# EAGLE design CME_BLE_Light (EAGLE 8.6.3)

## Sheet 1 of 3
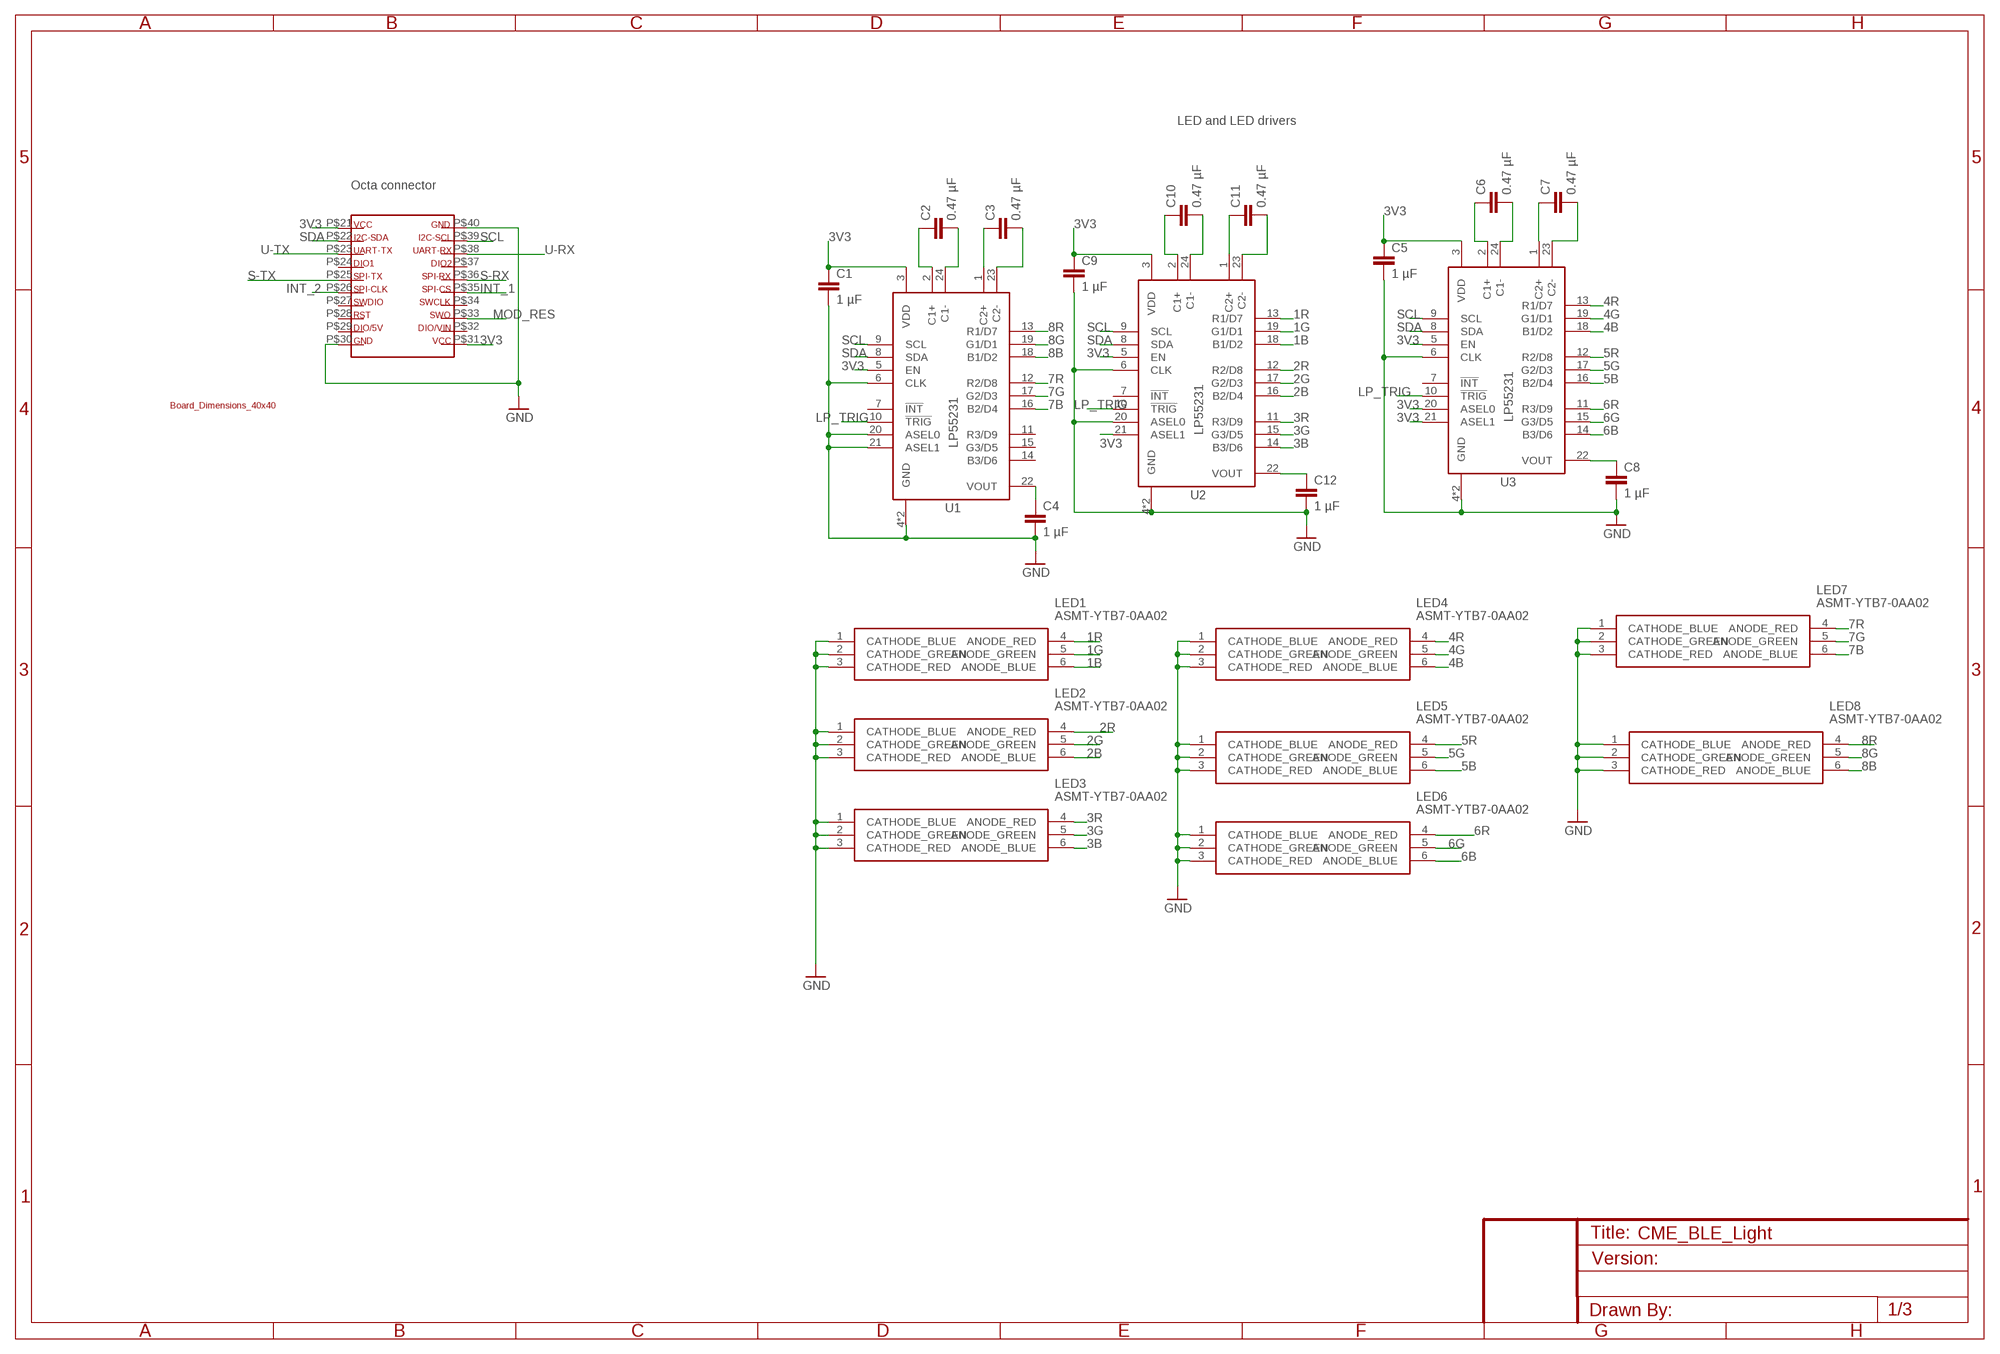
[diagram p0: schematic, sheet 1]

### Parts
C1  1 µF  SPARKFUN_CAP0402-CAP  [SPARKFUN_0402-CAP]
C2  0.47 µF  SPARKFUN_CAP0402-CAP  [SPARKFUN_0402-CAP]
C3  0.47 µF  SPARKFUN_CAP0402-CAP  [SPARKFUN_0402-CAP]
C4  1 µF  SPARKFUN_CAP0402-CAP  [SPARKFUN_0402-CAP]
C5  1 µF  SPARKFUN_CAP0402-CAP  [SPARKFUN_0402-CAP]
C6  0.47 µF  SPARKFUN_CAP0402-CAP  [SPARKFUN_0402-CAP]
C7  0.47 µF  SPARKFUN_CAP0402-CAP  [SPARKFUN_0402-CAP]
C8  1 µF  SPARKFUN_CAP0402-CAP  [SPARKFUN_0402-CAP]
C9  1 µF  SPARKFUN_CAP0402-CAP  [SPARKFUN_0402-CAP]
C10  0.47 µF  SPARKFUN_CAP0402-CAP  [SPARKFUN_0402-CAP]
C11  0.47 µF  SPARKFUN_CAP0402-CAP  [SPARKFUN_0402-CAP]
C12  1 µF  SPARKFUN_CAP0402-CAP  [SPARKFUN_0402-CAP]
LED1  ASMT-YTB7-0AA02  [ASMT-YTC7-0AA02]
LED2  ASMT-YTB7-0AA02  [ASMT-YTC7-0AA02]
LED3  ASMT-YTB7-0AA02  [ASMT-YTC7-0AA02]
LED4  ASMT-YTB7-0AA02  [ASMT-YTC7-0AA02]
LED5  ASMT-YTB7-0AA02  [ASMT-YTC7-0AA02]
LED6  ASMT-YTB7-0AA02  [ASMT-YTC7-0AA02]
LED7  ASMT-YTB7-0AA02  [ASMT-YTC7-0AA02]
LED8  ASMT-YTB7-0AA02  [ASMT-YTC7-0AA02]
U1  LP55231  LP55231WQFN  [WQFN-24]
U2  LP55231  LP55231WQFN  [WQFN-24]
U3  LP55231  LP55231WQFN  [WQFN-24]
U$2  OCTA-CORE_BOARD-DIMENSIONS-40X40  [OCTA-CORE_BOARD-DIMENSIONS-40X40]

### Nets
1B [GPIO]: LED1.6(ANODE_BLUE) U2.18(B1/D2)
1G [GPIO]: LED1.5(ANODE_GREEN) U2.19(G1/D1)
1R [GPIO]: LED1.4(ANODE_RED) U2.13(R1/D7)
2B [GPIO]: LED2.6(ANODE_BLUE) U2.16(B2/D4)
2G [GPIO]: LED2.5(ANODE_GREEN) U2.17(G2/D3)
2R [GPIO]: LED2.4(ANODE_RED) U2.12(R2/D8)
3B [GPIO]: LED3.6(ANODE_BLUE) U2.14(B3/D6)
3G [GPIO]: LED3.5(ANODE_GREEN) U2.15(G3/D5)
3R [GPIO]: LED3.4(ANODE_RED) U2.11(R3/D9)
3V3: C1.1 C5.1 C9.1 U1.3(VDD) U1.5(EN) U2.3(VDD) U2.5(EN) U2.21(ASEL1) U3.3(VDD) U3.5(EN) U3.20(ASEL0) U3.21(ASEL1) U$2.P$21 U$2.P$31 ; also sheet 2,3
4B [GPIO]: LED4.6(ANODE_BLUE) U3.18(B1/D2)
4G [GPIO]: LED4.5(ANODE_GREEN) U3.19(G1/D1)
4R [GPIO]: LED4.4(ANODE_RED) U3.13(R1/D7)
5B [GPIO]: LED5.6(ANODE_BLUE) U3.16(B2/D4)
5G [GPIO]: LED5.5(ANODE_GREEN) U3.17(G2/D3)
5R [GPIO]: LED5.4(ANODE_RED) U3.12(R2/D8)
6B [GPIO]: LED6.6(ANODE_BLUE) U3.14(B3/D6)
6G [GPIO]: LED6.5(ANODE_GREEN) U3.15(G3/D5)
6R [GPIO]: LED6.4(ANODE_RED) U3.11(R3/D9)
7B [GPIO]: LED7.6(ANODE_BLUE) U1.16(B2/D4)
7G [GPIO]: LED7.5(ANODE_GREEN) U1.17(G2/D3)
7R [GPIO]: LED7.4(ANODE_RED) U1.12(R2/D8)
8B [GPIO]: LED8.6(ANODE_BLUE) U1.18(B1/D2)
8G [GPIO]: LED8.5(ANODE_GREEN) U1.19(G1/D1)
8R [GPIO]: LED8.4(ANODE_RED) U1.13(R1/D7)
GND [GPIO]: C1.2 C4.2 C5.2 C8.2 C9.2 C12.2 LED1.1(CATHODE_BLUE) LED1.2(CATHODE_GREEN) LED1.3(CATHODE_RED) LED2.1(CATHODE_BLUE) LED2.2(CATHODE_GREEN) LED2.3(CATHODE_RED) LED3.1(CATHODE_BLUE) LED3.2(CATHODE_GREEN) LED3.3(CATHODE_RED) LED4.1(CATHODE_BLUE) LED4.2(CATHODE_GREEN) LED4.3(CATHODE_RED) LED5.1(CATHODE_BLUE) LED5.2(CATHODE_GREEN) LED5.3(CATHODE_RED) LED6.1(CATHODE_BLUE) LED6.2(CATHODE_GREEN) LED6.3(CATHODE_RED) LED7.1(CATHODE_BLUE) LED7.2(CATHODE_GREEN) LED7.3(CATHODE_RED) LED8.1(CATHODE_BLUE) LED8.2(CATHODE_GREEN) LED8.3(CATHODE_RED) U1.4(GND) U1.6(CLK) U1.20(ASEL0) U1.21(ASEL1) U1.EP(GND) U2.4(GND) U2.6(CLK) U2.20(ASEL0) U2.EP(GND) U3.4(GND) U3.6(CLK) U3.EP(GND) U$2.P$30 U$2.P$40 ; also sheet 2,3
INT_1 [GPIO]: U$2.P$35 ; also sheet 2
INT_2 [GPIO]: U$2.P$26 ; also sheet 2
LP_TRIG [GPIO]: U1.10(!TRIG) U2.10(!TRIG) U3.10(!TRIG) ; also sheet 2
MOD_RES [GPIO]: U$2.P$33 ; also sheet 2
N$1 [GPIO]: C2.2 U1.24(C1-)
N$2 [GPIO]: C2.1 U1.2(C1+)
N$4 [GPIO]: C3.1 U1.1(C2+)
N$5 [GPIO]: C3.2 U1.23(C2-)
N$7 [GPIO]: C10.1 U2.2(C1+)
N$8 [GPIO]: C10.2 U2.24(C1-)
N$9 [GPIO]: C11.1 U2.1(C2+)
N$10 [GPIO]: C11.2 U2.23(C2-)
N$11 [GPIO]: C6.1 U3.2(C1+)
N$13 [GPIO]: C6.2 U3.24(C1-)
N$14 [GPIO]: C7.1 U3.1(C2+)
N$15 [GPIO]: C7.2 U3.23(C2-)
N$16: C4.1 U1.22(VOUT)
N$17: C12.1 U2.22(VOUT)
N$18: C8.1 U3.22(VOUT)
S-RX [GPIO]: U$2.P$36 ; also sheet 2
S-TX [GPIO]: U$2.P$25 ; also sheet 2
SCL [GPIO]: U1.9(SCL) U2.9(SCL) U3.9(SCL) U$2.P$39 ; also sheet 2
SDA [GPIO]: U1.8(SDA) U2.8(SDA) U3.8(SDA) U$2.P$22 ; also sheet 2
U-RX [GPIO]: U$2.P$38 ; also sheet 2
U-TX [GPIO]: U$2.P$23 ; also sheet 2
Unconnected: U1.7(!INT) U1.11(R3/D9) U1.14(B3/D6) U1.15(G3/D5) U2.7(!INT) U3.7(!INT) U$2.P$24 U$2.P$27 U$2.P$28 U$2.P$29 U$2.P$32 U$2.P$34 U$2.P$37

### Notes on the sheet
- LED and LED drivers
- Octa connector

## Sheet 2 of 3
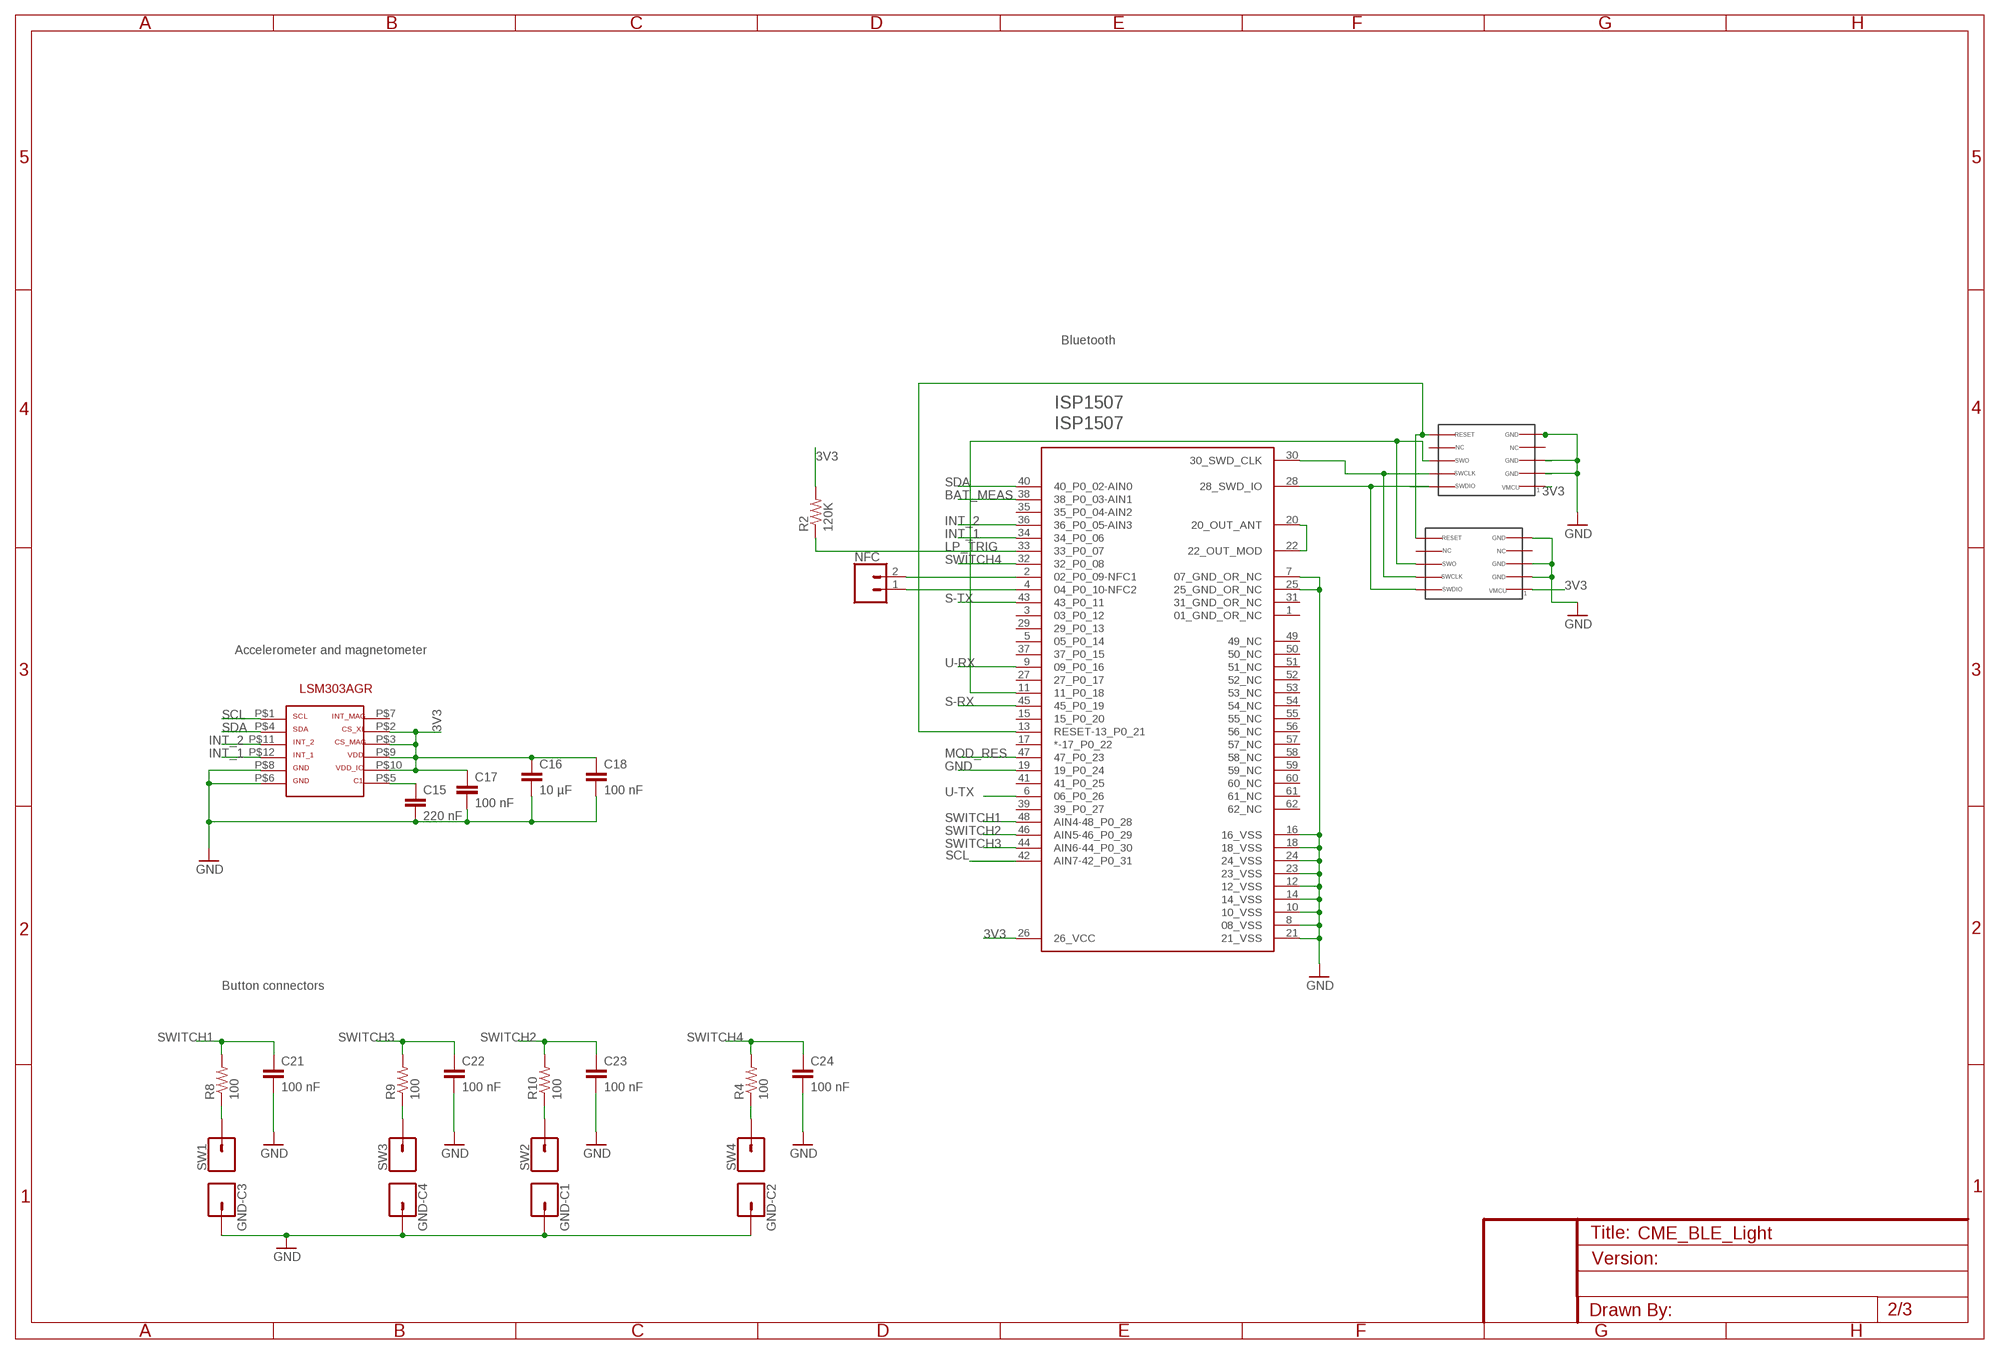
[diagram p1: schematic, sheet 2]

### Parts
C15  220 nF  SPARKFUN_CAP0402-CAP  [SPARKFUN_0402-CAP]
C16  10 µF  SPARKFUN_CAP0402-CAP  [SPARKFUN_0402-CAP]
C17  100 nF  SPARKFUN_CAP0402-CAP  [SPARKFUN_0402-CAP]
C18  100 nF  SPARKFUN_CAP0402-CAP  [SPARKFUN_0402-CAP]
C21  100 nF  SPARKFUN_CAP0402-CAP  [SPARKFUN_0402-CAP]
C22  100 nF  SPARKFUN_CAP0402-CAP  [SPARKFUN_0402-CAP]
C23  100 nF  SPARKFUN_CAP0402-CAP  [SPARKFUN_0402-CAP]
C24  100 nF  SPARKFUN_CAP0402-CAP  [SPARKFUN_0402-CAP]
GND-C1  CONN_01  [1X01]
GND-C2  CONN_01  [1X01]
GND-C3  CONN_01  [1X01]
GND-C4  CONN_01  [1X01]
ISP1507  ISP1507  [ISP1507]
LSM303AGR  LSM303AGRTR  [LSM303AGRTR]
NFC  CONN_02  [1X02]
R2  120K  SPARKFUN_RESISTOR0402-RES  [SPARKFUN_0402-RES]
R4  100  SPARKFUN_RESISTOR0402-RES  [SPARKFUN_0402-RES]
R8  100  SPARKFUN_RESISTOR0402-RES  [SPARKFUN_0402-RES]
R9  100  SPARKFUN_RESISTOR0402-RES  [SPARKFUN_0402-RES]
R10  100  SPARKFUN_RESISTOR0402-RES  [SPARKFUN_0402-RES]
SW1  CONN_01  [1X01]
SW2  CONN_01  [1X01]
SW3  CONN_01  [1X01]
SW4  CONN_01  [1X01]
U$1  DRAGAN-PERSONAL_SEGGER-CONN  [DRAGAN-PERSONAL_SEGGER-CONN]
U$3  DRAGAN-PERSONAL_SEGGER-CONN  [DRAGAN-PERSONAL_SEGGER-CONN]

### Nets
3V3: C16.1 C17.1 C18.1 ISP1507.26(26_VCC) LSM303AGR.P$2 LSM303AGR.P$3 LSM303AGR.P$9 LSM303AGR.P$10 R2.2 U$1.P$5 U$3.P$5 ; also sheet 1,3
BAT_MEAS [GPIO]: ISP1507.38(38_P0_03-AIN1) ; also sheet 3
GND [GPIO]: C15.2 C16.2 C17.2 C18.2 C21.2 C22.2 C23.2 C24.2 GND-C1.1 GND-C2.1 GND-C3.1 GND-C4.1 ISP1507.7(07_GND_OR_NC) ISP1507.8(08_VSS) ISP1507.10(10_VSS) ISP1507.12(12_VSS) ISP1507.14(14_VSS) ISP1507.16(16_VSS) ISP1507.18(18_VSS) ISP1507.19(19_P0_24) ISP1507.21(21_VSS) ISP1507.23(23_VSS) ISP1507.24(24_VSS) ISP1507.25(25_GND_OR_NC) LSM303AGR.P$6 LSM303AGR.P$8 U$1.P$1 U$1.P$3 U$1.P$4 U$3.P$1 U$3.P$3 U$3.P$4 ; also sheet 1,3
INT_1 [GPIO]: ISP1507.34(34_P0_06) LSM303AGR.P$12 ; also sheet 1
INT_2 [GPIO]: ISP1507.36(36_P0_05-AIN3) LSM303AGR.P$11 ; also sheet 1
LP_TRIG [GPIO]: ISP1507.33(33_P0_07) R2.1 ; also sheet 1
MOD_RES [GPIO]: ISP1507.47(47_P0_23) ; also sheet 1
N$22 [GPIO]: C15.1 LSM303AGR.P$5
N$24 [GPIO]: ISP1507.20(20_OUT_ANT) ISP1507.22(22_OUT_MOD)
N$25 [GPIO]: ISP1507.2(02_P0_09-NFC1) NFC.2
N$26 [GPIO]: ISP1507.4(04_P0_10-NFC2) NFC.1
N$27: R8.1 SW1.1
N$28: R10.1 SW2.1
N$31: R9.1 SW3.1
N$32: R4.1 SW4.1
RST [GPIO]: ISP1507.13(RESET-13_P0_21) U$1.P$10 U$3.P$10
S-RX [GPIO]: ISP1507.45(45_P0_19) ; also sheet 1
S-TX [GPIO]: ISP1507.43(43_P0_11) ; also sheet 1
SCL [GPIO]: ISP1507.42(AIN7-42_P0_31) LSM303AGR.P$1 ; also sheet 1
SDA [GPIO]: ISP1507.40(40_P0_02-AIN0) LSM303AGR.P$4 ; also sheet 1
SWCLK [GPIO]: ISP1507.30(30_SWD_CLK) U$1.P$7 U$3.P$7
SWDIO [GPIO]: ISP1507.28(28_SWD_IO) U$1.P$6 U$3.P$6
SWITCH1 [GPIO]: C21.1 ISP1507.48(AIN4-48_P0_28) R8.2
SWITCH2 [GPIO]: C23.1 ISP1507.46(AIN5-46_P0_29) R10.2
SWITCH3 [GPIO]: C22.1 ISP1507.44(AIN6-44_P0_30) R9.2
SWITCH4 [GPIO]: C24.1 ISP1507.32(32_P0_08) R4.2
SWO [GPIO]: ISP1507.11(11_P0_18) U$1.P$8 U$3.P$8
U-RX [GPIO]: ISP1507.9(09_P0_16) ; also sheet 1
U-TX [GPIO]: ISP1507.6(06_P0_26) ; also sheet 1
Unconnected: ISP1507.3(03_P0_12) ISP1507.5(05_P0_14) ISP1507.15(15_P0_20) ISP1507.17(*-17_P0_22) ISP1507.27(27_P0_17) ISP1507.29(29_P0_13) ISP1507.35(35_P0_04-AIN2) ISP1507.37(37_P0_15) ISP1507.39(39_P0_27) ISP1507.41(41_P0_25) ISP1507.49(49_NC) ISP1507.50(50_NC) ISP1507.51(51_NC) ISP1507.52(52_NC) ISP1507.53(53_NC) ISP1507.54(54_NC) ISP1507.55(55_NC) ISP1507.56(56_NC) ISP1507.57(57_NC) ISP1507.58(58_NC) ISP1507.59(59_NC) ISP1507.60(60_NC) ISP1507.61(61_NC) ISP1507.62(62_NC) LSM303AGR.P$7 U$1.P$2 U$1.P$9 U$3.P$2 U$3.P$9

### Notes on the sheet
- Bluetooth
- Accelerometer and magnetometer
- Button connectors

## Sheet 3 of 3
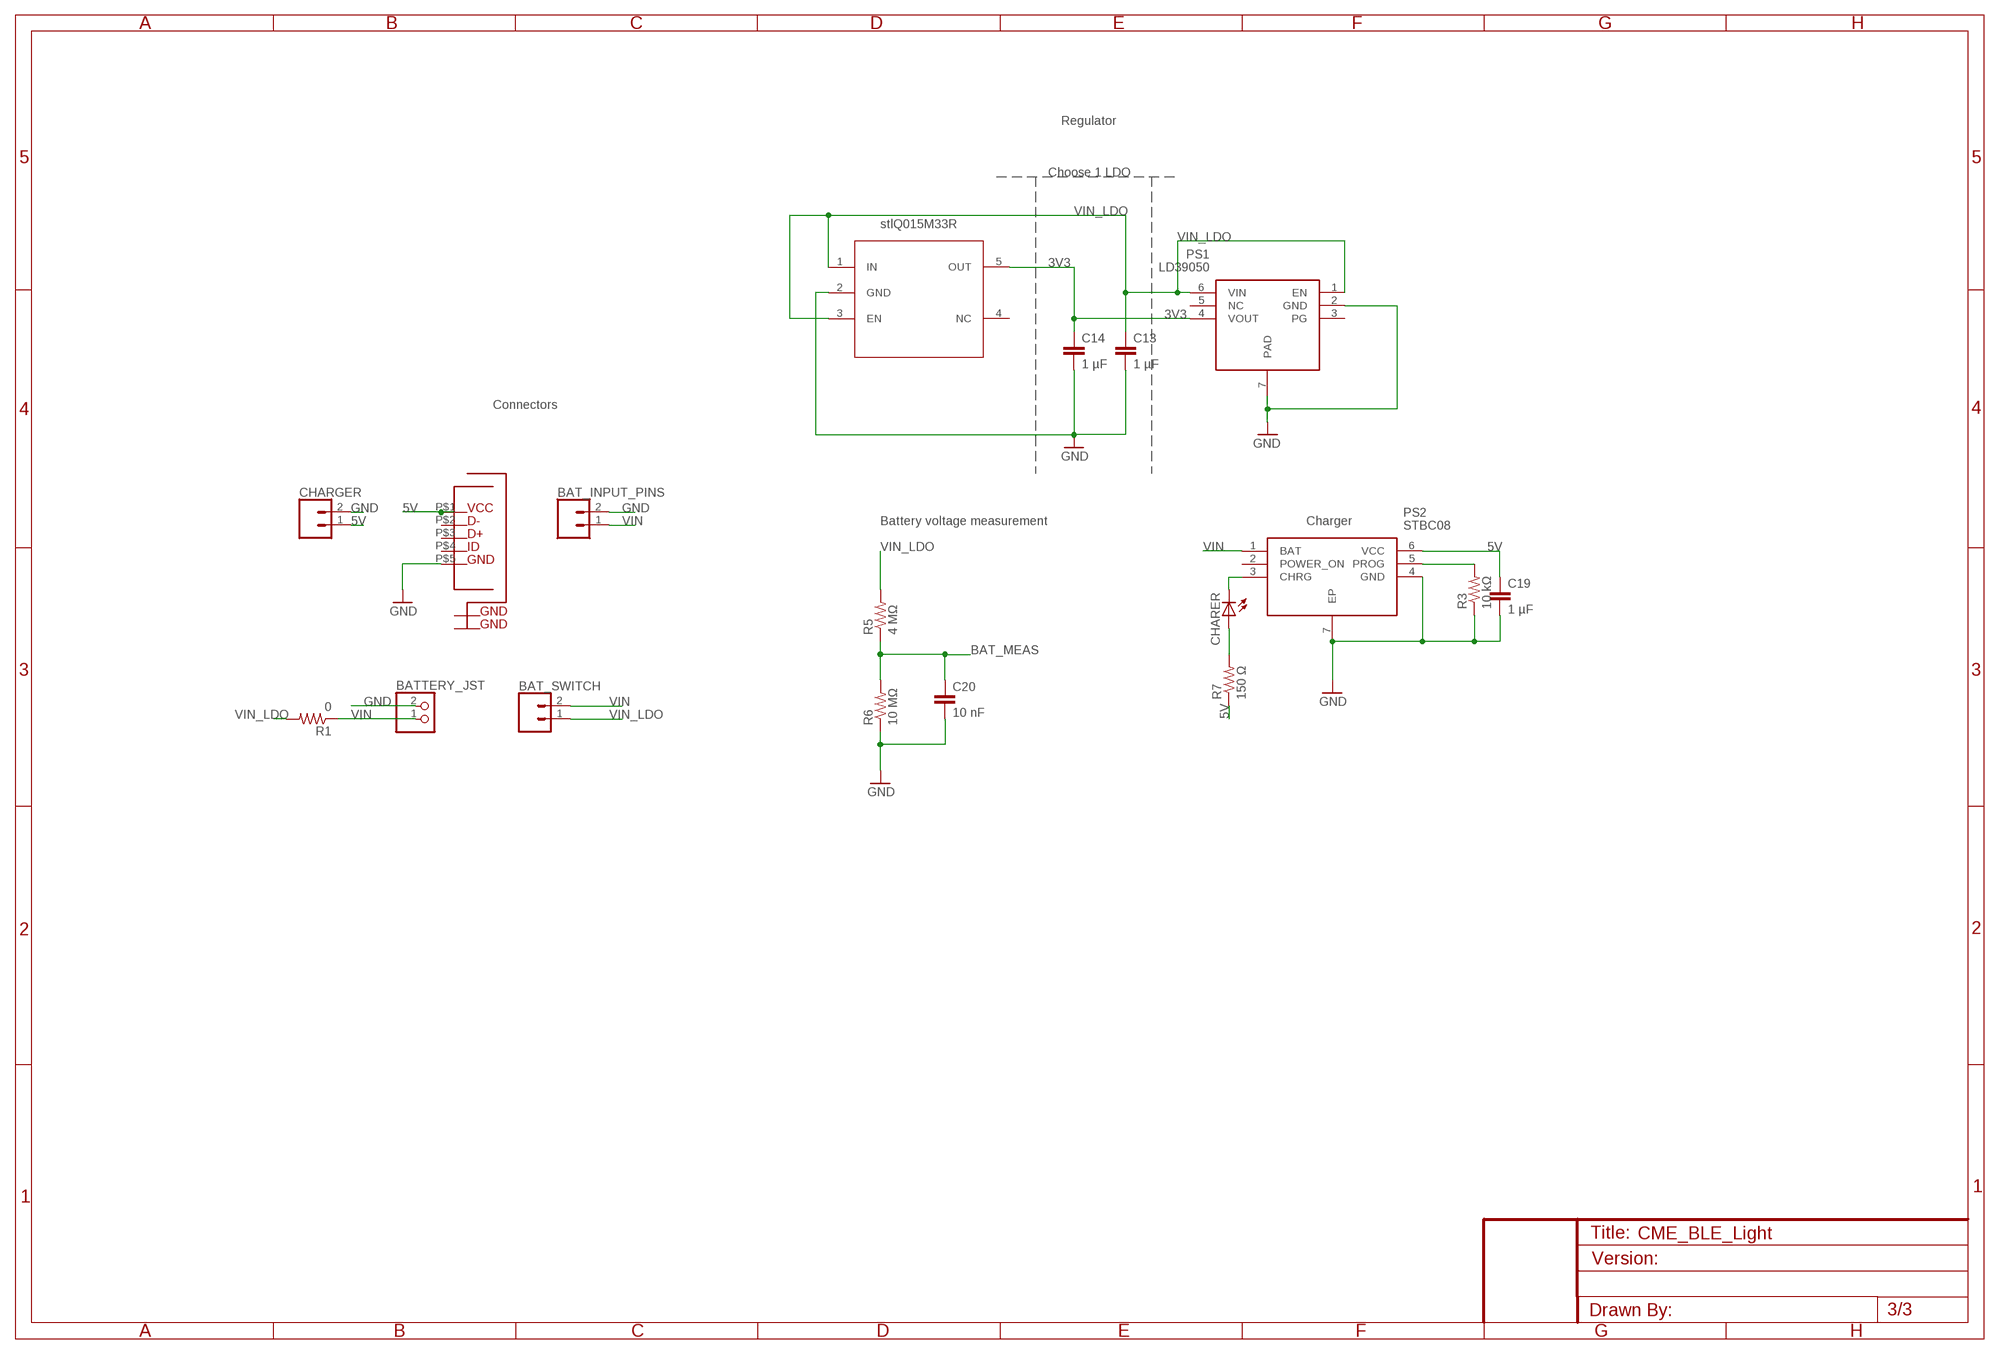
[diagram p2: schematic, sheet 3]

### Parts
BAT_INPUT_PINS  CONN_02  [1X02]
BAT_SWITCH  CONN_02  [1X02]
BATTERY_JST  ADAFRUIT_JST_2PIN-SMT-RA  [ADAFRUIT_JST-PH-2-SMT-RA]
C13  1 µF  SPARKFUN_CAP0402-CAP  [SPARKFUN_0402-CAP]
C14  1 µF  SPARKFUN_CAP0402-CAP  [SPARKFUN_0402-CAP]
C19  1 µF  SPARKFUN_CAP0402-CAP  [SPARKFUN_0402-CAP]
C20  10 nF  SPARKFUN_CAP0402-CAP  [SPARKFUN_0402-CAP]
CHARER  LED_LEDSML0603  [LED_SML0603]
CHARGER  CONN_02  [1X02]
PS1  LD39050  LD39050PU33R  [SON95P300X300X100-7N]
PS2  STBC08  STBC08PMR  [SON95P300X300X100-7N]
R1  0  SPARKFUN_RESISTOR0402-RES  [SPARKFUN_0402-RES]
R3  10 kΩ  SPARKFUN_RESISTOR0402-RES  [SPARKFUN_0402-RES]
R5  4 MΩ  SPARKFUN_RESISTOR0402-RES  [SPARKFUN_0402-RES]
R6  10 MΩ  SPARKFUN_RESISTOR0402-RES  [SPARKFUN_0402-RES]
R7  150 Ω  SPARKFUN_RESISTOR0402-RES  [SPARKFUN_0402-RES]
STLQ015  STLQ015M33R  [SOT95P290X145-5N]
U$4  OCTA-CORE_MCIRO-USB2  [OCTA-CORE_MICRO-USB2]

### Nets
3V3: C14.1 PS1.4(VOUT) STLQ015.5(OUT) ; also sheet 1,2
5V: C19.1 CHARGER.1 PS2.6(VCC) R7.1 U$4.P$1
BAT_MEAS [GPIO]: C20.1 R5.1 R6.2 ; also sheet 2
GND [GPIO]: BAT_INPUT_PINS.2 BATTERY_JST.2 C13.2 C14.2 C19.2 C20.2 CHARGER.2 PS1.2(GND) PS1.7(PAD) PS2.4(GND) PS2.7(EP) R3.1 R6.1 STLQ015.2(GND) U$4.P$5 ; also sheet 1,2
N$23: PS2.5(PROG) R3.2
N$29: CHARER.C PS2.3(CHRG)
N$30: CHARER.A R7.2
VIN: BAT_INPUT_PINS.1 BAT_SWITCH.2 BATTERY_JST.1 PS2.1(BAT) R1.1
VIN_LDO: BAT_SWITCH.1 C13.1 PS1.1(EN) PS1.6(VIN) R1.2 R5.2 STLQ015.1(IN) STLQ015.3(EN)
Unconnected: PS1.3(PG) PS1.5(NC) PS2.2(POWER_ON) STLQ015.4(NC) U$4.P$2 U$4.P$3 U$4.P$4 U$4.P$6 U$4.P$7 U$4.P$8 U$4.P$9 U$4.P$10 U$4.P$11 U$4.P$12 U$4.P$13

### Notes on the sheet
- Regulator
- Choose 1 LDO
- stlQ015M33R
- Connectors
- Battery voltage measurement | Charger

## Power pins joined to a net without a drawn wire
01_GND_OR_NC: ISP1507.1(01_GND_OR_NC)
31_GND_OR_NC: ISP1507.31(31_GND_OR_NC)

## Library data of the parts
BAT_INPUT_PINS BAT_SWITCH CHARGER NFC = SparkFun-Connectors:CONN_02: Multi connection point. Often used as Generic Header-pin footprint for 0.1 inch spaced/style header connections On any of the 0.1 inch spaced packages, you can populate with these: Break Away Headers - Straight <https://www.sparkfun.com/products/116> (PRT-00116) Break Away Male Headers - Right Angle <https://www.sparkfun.com/products/553> (PRT-00553) Female Headers <https://www.sparkfun.com/products/115> (PRT-00115) Break Away Headers - Machine Pin <https://www.sparkfun.com/products/117> (PRT-00117) Break Away Female Headers - Swiss Machine Pin <https://www.sparkfun.com/products/743> (PRT-00743) For SCREWTERMINALS and SPRING TERMINALS visit here: Screw Terimnals on SparkFun.com <https://www.sparkfun.com/search/results?term=Screw+Terminals> (5mm/3.5mm/2.54mm spacing) This device is also useful as a general connection point to wire up your design to another part of your project. Our various solder wires solder well into these plated through hole pads. Hook-Up Wire - Assortment (Stranded, 22 AWG) <https://www.sparkfun.com/products/11375> (PRT-11375) Hook-Up Wire - Assortment (Solid Core, 22 AWG) <https://www.sparkfun.com/products/11367> (PRT-11367) View the entire wire category on our website here <https://www.sparkfun.com/categories/141> Special notes: Molex polarized connector foot print use with: PRT-08233 with associated crimp pins and housings. 2.54_SCREWTERM for use with PRT-10571. 3.5mm Screw Terminal footprints for PRT-08084 5mm Screw Terminal footprints for use with PRT-08432
BATTERY_JST = OCTA-EZR_v1:ADAFRUIT_JST_2PIN: JST 2-Pin Connectors of various flavors SMT-RA (S2B-PH-SM4) 4UConnector #17311 SMT (B2B-PH-SM4) THM-RA (S2B-PH) THM (B2B-PH)
C1-C24 = OCTA-EZR_v1:SPARKFUN_CAP: Capacitor Standard 0603 ceramic capacitor, and 0.1" leaded capacitor.
CHARER = OCTA-EZR_v0.1:LED_LED: LED OSRAM: - CHIPLED LG R971, LG N971, LY N971, LG Q971, LY Q971, LO R971, LY R971 LH N974, LH R974 LS Q976, LO Q976, LY Q976 LO Q996 - Hyper CHIPLED LW Q18S LB Q993, LB Q99A, LB R99A - SideLED LS A670, LO A670, LY A670, LG A670, LP A670 LB A673, LV A673, LT A673, LW A673 LH A674 LY A675 LS A676, LA A676, LO A676, LY A676, LW A676 LS A679, LY A679, LG A679 - Hyper Micro SIDELED® LS Y876, LA Y876, LO Y876, LY Y876 LT Y87S - SmartLED LW L88C, LW L88S LB L89C, LB L89S, LG L890 LS L89K, LO L89K, LY L89K LS L896, LA L896, LO L896, LY L896 - TOPLED LS T670, LO T670, LY T670, LG T670, LP T670 LSG T670, LSP T670, LSY T670, LOP T670, LYG T670 LG T671, LOG T671, LSG T671 LB T673, LV T673, LT T673, LW T673 LH T674 LS T676, LA T676, LO T676, LY T676, LB T676, LH T676, LSB T676, LW T676 LB T67C, LV T67C, LT T67C, LS T67K, LO T67K, LY T67K, LW E67C LS E67B, LA E67B, LO E67B, LY E67B, LB E67C, LV E67C, LT E67C LW T67C LS T679, LY T679, LG T679 LS T770, LO T770, LY T770, LG T770, LP T770 LB T773, LV T773, LT T773, LW T773 LH T774 LS E675, LA E675, LY E675, LS T675 LS T776, LA T776, LO T776, LY T776, LB T776 LHGB T686 LT T68C, LB T68C - Hyper Mini TOPLED® LB M676 - Mini TOPLED Santana® LG M470 LS M47K, LO M47K, LY M47K Source: http://www.osram.convergy.de LUXEON: - LUMILED® LXK2-PW12-R00, LXK2-PW12-S00, LXK2-PW14-U00, LXK2-PW14-V00 LXK2-PM12-R00, LXK2-PM12-S00, LXK2-PM14-U00 LXK2-PE12-Q00, LXK2-PE12-R00, LXK2-PE12-S00, LXK2-PE14-T00, LXK2-PE14-U00 LXK2-PB12-K00, LXK2-PB12-L00, LXK2-PB12-M00, LXK2-PB14-N00, LXK2-PB14-P00, LXK2-PB14-Q00 LXK2-PR12-L00, LXK2-PR12-M00, LXK2-PR14-Q00, LXK2-PR14-R00 LXK2-PD12-Q00, LXK2-PD12-R00, LXK2-PD12-S00 LXK2-PH12-R00, LXK2-PH12-S00 LXK2-PL12-P00, LXK2-PL12-Q00, LXK2-PL12-R00 Source: www.luxeon.com KINGBRIGHT: KA-3528ASYC Source: www.kingbright.com
GND-C1-GND-C4 SW1-SW4 = SparkFun-Connectors:CONN_01: Single connection point. Often used as Generic Header-pin footprint for 0.1 inch spaced/style header connections On any of the 0.1 inch spaced packages, you can populate with these: Break Away Headers - Straight <https://www.sparkfun.com/products/116> (PRT-00116) Break Away Male Headers - Right Angle <https://www.sparkfun.com/products/553> (PRT-00553) Female Headers <https://www.sparkfun.com/products/115> (PRT-00115) Break Away Headers - Machine Pin <https://www.sparkfun.com/products/117> (PRT-00117) Break Away Female Headers - Swiss Machine Pin <https://www.sparkfun.com/products/743> (PRT-00743) This device is also useful as a general connection point to wire up your design to another part of your project. Our various solder wires solder well into these plated through hole pads. Hook-Up Wire - Assortment (Stranded, 22 AWG) <https://www.sparkfun.com/products/11375> (PRT-11375) Hook-Up Wire - Assortment (Solid Core, 22 AWG) <https://www.sparkfun.com/products/11367> (PRT-11367) View the entire wire category on our website here <https://www.sparkfun.com/categories/141> Special notes: SMTSO-256-ET is a "flush mount" nut for a 4-40 screw. We mostly use this on specialty testbeds; it is a nice way to connect hardware to your PCB at an adjustable hieght. Also note, the SNAP packages are for using a snappable style connector. We sell a baggie of snaps and they are also used on two LilyPad designs: Snap Assortment - 30 pack (male and female) <https://www.sparkfun.com/products/11347> (DEV-11347) LilyPad Arduino SimpleSnap <https://www.sparkfun.com/products/10941> (DEV-10941) LilyPad SimpleSnap Protoboard <https://www.sparkfun.com/products/10940> (DEV-10940)
ISP1507 = ISP1507:ISP1507: ISP1507 BLE Module Based on the nRF52832 Bluetooth Low Energy Chip with Integrated Antenna, oscillators and Power Supply http://www.insightsip.com/products/bluetooth-smart-modules/isp1507
LED1-LED8 = ASMT-YTB7-0AA02:ASMT-YTB7-0AA02: Broadcom ASMT-YTB7-0AA02 3 RGB LED, 469 / 529 / 623 nm PLCC 6, Square Lens SMD package Source: Datasheet <https://docs.broadcom.com/docs/AV02-3793EN>; DESCRIPTION: Broadcom ASMT-YTB7-0AA02 3 RGB LED, 469 / 529 / 623 nm PLCC 6, Square Lens SMD package; HEIGHT: mm; MANUFACTURER_NAME: Broadcom; MANUFACTURER_PART_NUMBER: ASMT-YTB7-0AA02; RS_PART_NUMBER: 8399926P; RS_PRICE/STOCK: http://uk.rs-online.com/web/p/products/8399926P
LSM303AGR = OCTA_v2:LSM303AGRTR
PS1 = LD39050PU33R:LD39050PU33R: STMICROELECTRONICS - LD39050PU33R - LDO, FIXED, 3.3V, 0.5A, DFN-6 Source: Datasheet <https://componentsearchengine.com/Datasheets/2/LD39050PU33R.pdf>; DESCRIPTION: STMICROELECTRONICS - LD39050PU33R - LDO, FIXED, 3.3V, 0.5A, DFN-6; HEIGHT: 1mm; MANUFACTURER_NAME: STMicroelectronics; MANUFACTURER_PART_NUMBER: LD39050PU33R
PS2 = STBC08PMR:STBC08PMR: STMicroelectronics STBC08PMR, Battery Charger, 800mA, 6-Pin DFN Source: Datasheet <https://componentsearchengine.com/Datasheets/2/STBC08PMR.pdf>; ARROW_PART_NUMBER: STBC08PMR; ARROW_PRICE/STOCK: https://www.arrow.com/en/products/stbc08pmr/stmicroelectronics; DESCRIPTION: STMicroelectronics STBC08PMR, Battery Charger, 800mA, 6-Pin DFN; HEIGHT: 1mm; MANUFACTURER_NAME: STMicroelectronics; MANUFACTURER_PART_NUMBER: STBC08PMR; RS_PART_NUMBER: 1655533; RS_PRICE/STOCK: http://uk.rs-online.com/web/p/products/1655533
R1-R10 = OCTA-EZR_v1:SPARKFUN_RESISTOR: Resistor Basic schematic elements and footprints for 0603, 1206, and PTH resistors.
STLQ015 = SOT95P290X145-5N:STLQ015M33R
U1-U3 = LP55231:LP55231; PROD_ID: IC-13302
U$1 U$3 = OCTA-EZR_v1:DRAGAN-PERSONAL_SEGGER-CONN
U$2 = OCTA-EZR_v1:OCTA-CORE_BOARD-DIMENSIONS-40X40
U$4 = OCTA-EZR_v1:OCTA-CORE_MCIRO-USB2: Micr MICRO USB TYPE B RCPT W/ REAR PEGS. Mouser: 649-10118194-0001LF

## Net classes
0 default: width 0.254 mm
1 GPIO: width 0.203 mm

## Board
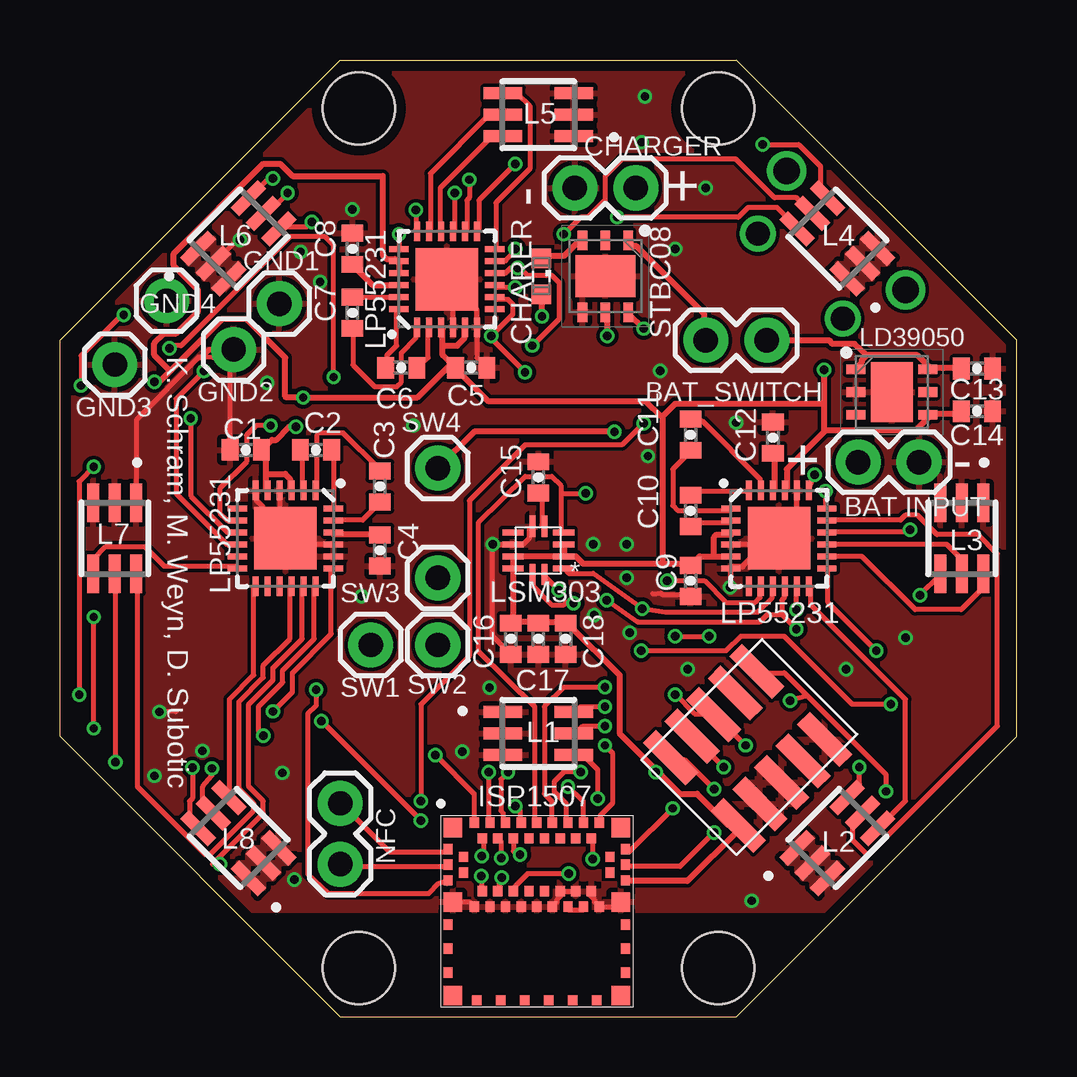
[diagram p3: board, top side]
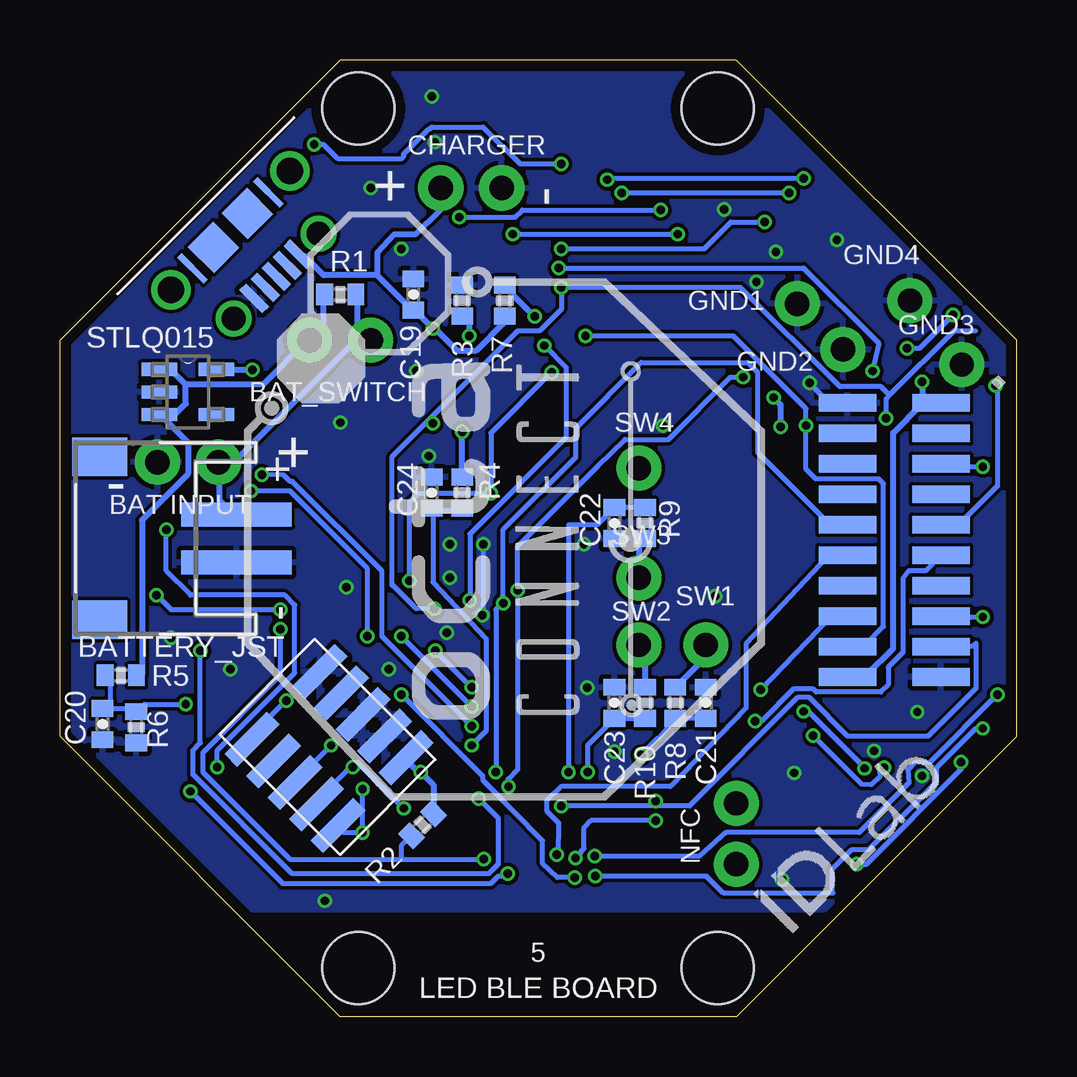
[diagram p4: board, bottom side, seen from below]

Size 39.88 x 39.88 mm. Coordinates in mm from the lower left corner, seen from the top.
Copper layers (1*16): Top 0.018mm / dielectric 1.55mm / Bottom 0.018mm
Design rules "eC_2Layer_PClass6_BaseCopperO18_eCDefault *": minimum track width 0.15mm, minimum drill 0.35mm, track to track 0.151mm, track to pad 0.151mm, pad to pad 0.151mm, via to via 0.151mm, smd to smd 0mil, copper to edge 0.45mm, drill to drill 0.45mm, minimum pad ring 0.175mm, minimum via ring 0.125mm, stop-mask expansion 0mil, vias tented up to drill 0.45mm, thermal gap 0.2mm
tRestrict: 4 lines
bRestrict: 4 lines

### Footprints (pad centres in the part's own frame; a part is rotated, then mirrored left to right if it is on the bottom)
1X02 = drill 1.016 pad 1.88: 1 0,0; 2 2.54,0
ADAFRUIT_JST-PH-2-SMT-RA = smd 1 x 4.6: 1 1,-3.7; 2 -1,-3.7 | smd 1.6 x 2.286: NC1 -3.4,2.008; NC2 3.4,2.008
SPARKFUN_0402-CAP = smd 0.7 x 0.9: 1 -0.65,0; 2 0.65,0
LED_SML0603 = smd 0.8 x 0.8: A 0.75,0; C -0.75,0
1X01 = drill 1.016 pad 1.88: 1 0,0
ISP1507 = smd 0.8 x 0.8: 1 0.5,7.5; 7 0.5,4.4; 25 7.5,4.4; 31 7.5,7.5; 52 0.5,0.5; 59 7.5,0.5 | smd 0.4 x 0.4: 2 0.3,6.6; 3 0.95,6.275; 4 0.3,5.95; 5 0.95,5.625; 6 0.3,5.3; 8 1.4,4.2; 9 1.725,4.85; 10 2.05,4.2; 11 2.375,4.85; 12 2.7,4.2; 13 3.025,4.85; 14 3.35,4.2; 15 3.675,4.85; 16 4,4.2; 17 4.325,4.85; 18 4.65,4.2; 19 4.975,4.85; 20 5.3,4.2; 21 5.625,4.85; 22 5.95,4.2; 23 6.275,4.85; 24 6.6,4.2; 26 7.7,5.3; 27 7.05,5.625; 28 7.7,5.95; 29 7.05,6.275; 30 7.7,6.6; 32 6.6,7.7; 33 6.275,7.05; 34 5.95,7.7; 35 5.625,7.05; 36 5.3,7.7; 37 4.975,7.05; 38 4.65,7.7; 39 4.325,7.05; 40 4,7.7; 41 3.675,7.05; 42 3.35,7.7; 43 3.025,7.05; 44 2.7,7.7; 45 2.375,7.05; 46 2.05,7.7; 47 1.725,7.05; 48 1.4,7.7; 49 0.3,3.45; 50 0.3,2.45; 51 0.3,1.45; 53 1.5,0.3; 54 2.5,0.3; 55 3.5,0.3; 56 4.5,0.3; 57 5.5,0.3; 58 6.5,0.3; 60 7.7,1.45; 61 7.7,2.45; 62 7.7,3.45
ASMT-YTC7-0AA02 = smd 0.5 x 1.6: 1 0.9,1.475; 2 0,1.475; 3 -0.9,1.475; 4 -0.9,-1.475; 5 0,-1.475; 6 0.9,-1.475
LSM303AGRTR = smd 0.889 x 0.25: P$1 -0.304,1.5; P$2 -0.304,1; P$3 -0.304,0.5; P$4 -0.304,0; P$7 1.804,0; P$8 1.804,0.5; P$9 1.804,1; P$10 1.804,1.5 | smd 0.25 x 0.889: P$5 0.5,-0.254; P$6 1,-0.254; P$11 1,1.754; P$12 0.5,1.754
SON95P300X300X100-7N = smd 0.8 x 0.4: 1 -1.5,0.95; 2 -1.5,0; 3 -1.5,-0.95; 4 1.5,-0.95; 5 1.5,0; 6 1.5,0.95 | smd 1.75 x 2.5: 7 0,0
SPARKFUN_0402-RES = smd 0.7 x 0.9: 1 -0.65,0; 2 0.65,0
SOT95P290X145-5N = smd 1.473 x 0.559: 1 -1.194,0.94; 2 -1.194,0; 3 -1.194,-0.94; 4 1.194,-0.94; 5 1.194,0.94
WQFN-24 = smd 0.8 x 0.25: 1 -2,1.25; 2 -2,0.75; 3 -2,0.25; 4 -2,-0.25; 5 -2,-0.75; 6 -2,-1.25; 13 2,-1.25; 14 2,-0.75; 15 2,-0.25; 16 2,0.25; 17 2,0.75; 18 2,1.25 | smd 0.25 x 0.8: 7 -1.25,-2; 8 -0.75,-2; 9 -0.25,-2; 10 0.25,-2; 11 0.75,-2; 12 1.25,-2; 19 1.25,2; 20 0.75,2; 21 0.25,2; 22 -0.25,2; 23 -0.75,2; 24 -1.25,2 | smd 2.6 x 2.6: EP 0,0
DRAGAN-PERSONAL_SEGGER-CONN = smd 2.5 x 0.75: P$1 0,0; P$2 0,1.27; P$3 0,2.54; P$4 0,3.81; P$5 0,5.08; P$6 4,5.08; P$7 4,3.81; P$8 4,2.54; P$9 4,1.27; P$10 4,0
OCTA-CORE_BOARD-DIMENSIONS-40X40 = smd 2.4 x 0.74 bottom: P$21 7.05,2.47; P$22 7.05,3.74; P$23 7.05,5.01; P$24 7.05,6.28; P$25 7.05,7.55; P$26 7.05,8.82; P$27 7.05,10.09; P$28 7.05,11.36; P$29 7.05,12.63; P$30 7.05,13.9; P$31 3.15,13.9; P$32 3.15,12.63; P$33 3.15,11.36; P$34 3.15,10.09; P$35 3.15,8.82; P$36 3.15,7.55; P$37 3.15,6.28; P$38 3.15,5.01; P$39 3.15,3.74; P$40 3.15,2.47 | hole 3: 27.44,26.17; 27.44,-9.66; 12.454,26.17; 12.454,-9.66
OCTA-CORE_MICRO-USB2 = smd 0.4 x 1.35: P$1 -1.3,0; P$2 -0.65,0; P$3 0,0; P$4 0.65,0; P$5 1.3,0 | drill 1 pad 1.5: P$6 -2.5,0; P$7 2.5,0 | smd 1.5 x 1.55: P$8 1,-2.7; P$9 -1,-2.7 | smd 0.254 x 1.55: P$10 -2.235,-2.7; P$11 2.235,-2.7 | drill 1.1 pad 1.6: P$12 -3.5,-2.7; P$13 3.5,-2.7

### Placement (x,y rotation side)
BAT_INPUT_PINS  33.27,23.11 0 top
BAT_SWITCH  29.46,28.19 180 top
BATTERY_JST  36.22,19.94 90 bottom
C1  7.75,23.62 180 top
C2  10.67,23.62 0 top
C3  13.34,22.1 270 top
C4  13.34,19.43 270 top
C5  17.15,27.05 0 top
C6  14.22,27.05 180 top
C7  12.19,29.34 90 top
C8  12.19,32 90 top
C9  26.29,18.16 270 top
C10  26.29,21.08 90 top
C11  26.29,24.26 90 top
C12  29.72,24.13 90 top
C13  38.23,27.01 0 top
C14  38.23,25.24 0 top
C15  19.94,22.48 90 top
C16  18.8,15.75 270 top
C17  19.94,15.75 270 top
C18  21.08,15.75 270 top
C19  25.15,30.1 90 bottom
C20  38.1,12.19 270 bottom
C21  12.95,13.08 90 bottom
C22  16.76,20.57 270 bottom
C23  16.76,13.08 90 bottom
C24  24.38,21.84 90 bottom
CHARER  20.07,30.86 270 top
CHARGER  24,34.54 180 top
GND-C1  4.45,29.84 0 top
GND-C2  2.29,27.18 0 top
GND-C3  7.24,27.81 0 top
GND-C4  9.14,29.72 0 top
ISP1507  15.87,0.38 0 top
LED1  19.94,11.81 90 top
LED2  32.41,7.44 135 top
LED3  37.59,19.94 0 top
LED4  32.41,32.44 225 top
LED5  19.94,37.59 270 top
LED6  7.44,32.44 135 top
LED7  2.29,19.94 0 top
LED8  7.44,7.44 225 top
LSM303AGR  20.69,20.18 180 top
NFC  11.68,6.35 90 top
PS1  34.67,26.03 0 top
PS2  22.73,30.86 270 top
R1  28.19,30.1 180 bottom
R2  24.77,8 45 bottom
R3  23.11,29.84 270 bottom
R4  23.11,21.84 270 bottom
R5  37.34,14.22 0 bottom
R6  36.7,12.06 90 bottom
R7  21.34,29.84 90 bottom
R8  14.22,13.08 270 bottom
R9  15.49,20.57 90 bottom
R10  15.49,13.08 270 bottom
STLQ015  34.54,26.03 0 bottom
SW1  12.95,15.49 0 top
SW2  15.75,15.49 0 top
SW3  15.75,18.29 0 top
SW4  15.75,22.86 0 top
U1  9.4,19.94 270 top
U2  29.97,19.94 0 top
U3  16.13,30.73 90 top
U$1  31.88,11.56 135 top
U$2  0,11.68 0 top
U$3  29.04,14.39 225 bottom
U$4  30.86,30.86 225 bottom

### Tracks (layer width: path | path; a pad name or v marks a point on that pad's centre or on a via)
1B  (via drill 0.35)
  Top 0.203: v31.91,21.91 31.91,21.2 U2.18 | v25.65,15.85 v27.06,15.85 | v22.72,12.92 21.71,12.92 21.51,12.72 LED1.6
  Bottom 0.203: v31.91,21.91 30.29,21.91 27.06,18.68 v27.06,15.85 | v22.72,12.92 v25.65,15.85
1G  (via drill 0.35)
  Top 0.203: v31.46,22.59 31.2,22.01 U2.19 | v22.72,12.11 21.81,12.11 21.51,11.81 LED1.5
  Bottom 0.203: v31.46,22.59 30.55,22.57 30.29,22.31 30.19,22.31 26.46,18.58 26.46,15.85 v22.72,12.11
1R  (via drill 0.35)
  Top 0.203: v34.03,15.24 32.01,17.27 32.01,18.68 U2.13 | v22.42,9.08 22.42,10.3 21.81,10.9 21.51,10.9 LED1.4
  Bottom 0.203: v34.03,15.24 34.03,11.41 34.33,11.1 34.33,10.09 30.19,5.95 22.01,5.95 21.61,6.36 21.61,8.28 v22.42,9.08
2B  (via drill 0.35)
  Top 0.203: v35.45,20.3 35.34,20.19 32.01,20.19 U2.16 | v33.32,10.4 33.32,9.69 32.82,9.19 LED2.6
  Bottom 0.203: v35.45,20.3 35.45,18.58 34.44,17.57 30.5,17.57 30.09,17.16 30.09,14.34 33.32,11.1 v33.32,10.4
2G
  Top 0.203: U2.17 32.01,20.7 35.04,20.7 35.24,20.9 35.75,20.9 36.56,20.09 38.27,20.09 39.08,19.28 39.08,12.11 33.73,6.76 33.63,6.76 33.02,7.37 33.02,8.07 33.43,8.48 LED2.5
2R
  Top 0.203: U2.12 31.3,17.87 31.3,17.16 35.24,13.22 35.24,8.98 34.13,7.87 LED2.4
3B
  Top 0.203: U2.14 32.01,19.18 33.43,19.18 35.65,16.96 37.57,16.96 38.48,17.87 38.48,18.38 LED3.6
3G
  Top 0.203: U2.15 36.96,19.69 37.57,19.08 37.57,18.48 LED3.5
3R  (via drill 0.35)
  Top 0.203: v30.7,16.96 30.7,17.87 U2.11 | v35.85,17.57 36.66,18.38 LED3.4
  Bottom 0.203: v30.7,16.96 35.24,16.96 v35.85,17.57
3V3  (via drill 0.35)
  Top 0.254: 15.95,27.97 15.95,27.57 16.46,27.06 C5.1 | 15.95,27.97 15.95,28.68 U3.3 | 15.95,27.97 16.56,27.97 16.86,28.27 16.86,28.68 U3.5 | U3.21 14.13,31 14.13,31.41 U3.20 14.03,31.51 13.96,31.58 13.61,31.58 13.45,31.74 13.45,35.04 | 8.58,22.62 8.58,23.43 8.48,23.53 C1.1 | 8.58,22.62 8.58,22.01 U1.5 | 8.58,22.62 9.39,22.62 9.59,22.42 9.59,22.01 U1.3 | 4.59,26.91 6.76,29.08 7.77,29.08 9.39,27.47 9.39,25.85 9.43,25.81 v10.13,25.81 14.9,25.81 16.26,27.16 C5.1 | 4.59,26.91 4.08,26.41 4.03,26.46 v3.93,26.46 | 8.58,23.53 C1.1 | 31.91,24.44 30.29,22.82 30.29,22.01 U2.21 | 31.91,24.44 35.65,24.44 36.25,25.04 PS1.4 36.25,25.14 37.77,25.14 C14.1 | 31.91,24.44 31.86,24.44 31.86,25.55 | 31.86,25.55 v31.86,26.96 | ISP1507.26 23.63,5.65 26.15,5.65 28.27,7.77 U$1.P$5 | 28.27,7.87 U$1.P$5 | 27.26,19.18 26.66,19.18 26.35,18.88 C9.1 26.25,18.88 25.14,18.88 | 27.26,19.18 U2.5 | 27.26,19.18 27.26,19.99 27.37,20.09 27.97,20.09 U2.3 | LSM303AGR.P$2 21,19.59 LSM303AGR.P$3 | LSM303AGR.P$2 20.9,19.18 18.98,19.18 LSM303AGR.P$9 18.88,19.08 18.88,18.78 LSM303AGR.P$10 18.88,18.58 18.88,16.56 C16.1 18.88,16.46 19.89,16.46 C17.1 19.99,16.46 21,16.46 C18.1 21.2,16.36 23.33,14.23 23.33,11.81 24.89,10.24 | 25.14,18.88 21.81,18.88 21.51,19.18 21.1,19.18 LSM303AGR.P$2 | 31.86,25.55 25.65,25.55 25.14,25.04 | 25.14,18.88 25.14,25.04 | C5.1 16.56,26.96 17.87,25.65 24.44,25.65 25.04,25.04 25.14,25.04 | 13.45,35.04 | 24.89,10.24 25.85,9.29 26.56,9.29 27.87,7.97 28.17,7.97 U$1.P$5 | v24.84,10.2 24.89,10.24 | 13.45,35.04 9.69,35.04 9.19,35.55 8.48,35.55 4.74,31.81 4.74,31.3 5.75,30.29 5.75,29.38 4.84,28.48 4.34,28.48 3.93,28.07 3.93,27.57 4.59,26.91
  Top 0.254: C1.1 8.84,24.04 9.02,24.04 9.55,24.59 v9.83,24.59
  Bottom 0.254: U$2.P$21 6.96,14.23 6.26,14.23 5.14,15.35 5.14,24.34 3.93,25.55 3.23,25.55 U$2.P$31 3.93,25.65 v3.93,26.46 | v31.86,26.96 33.32,26.96 STLQ015.5 | U$3.P$5 25.45,10.7 24.94,10.2 v24.84,10.2 24.3,9.66 R2.2 | v9.83,24.59 9.83,25.5 v10.13,25.81
4B  (via drill 0.35)
  Top 0.203: v14.84,33.63 14.84,32.82 U3.18 | v23.22,33.32 28.27,33.32 28.68,33.73 29.89,33.73 30.7,32.92 LED4.6
  Bottom 0.203: v14.84,33.63 20.6,33.63 20.9,33.32 v23.22,33.32
4G  (via drill 0.35)
  Top 0.203: v14.13,32.62 14.13,32.01 U3.19 | v21,32.62 21.71,33.32 22.01,33.32 22.72,34.03 22.72,35.04 23.43,35.75 28.17,35.75 29.79,34.13 30.7,34.13 31.3,33.53 LED4.5
  Bottom 0.203: v21,32.62 v14.13,32.62
4R  (via drill 0.35)
  Top 0.203: v18.98,35.55 17.47,34.03 17.47,32.82 U3.13 | 31.71,34.33 31.91,34.13 LED4.4 31.71,34.44 31.71,35.45 30.8,36.35 v29.28,36.35
  Bottom 0.203: v18.98,35.55 20.7,35.55 22.24,37.08 24.38,37.08 24.47,37 24.51,37 25.56,35.95 25.55,35.85 25.65,35.75 28.27,35.75 28.88,36.35 v29.28,36.35
5B
  Top 0.203: U3.16 15.85,32.82 15.85,34.54 17.97,36.66 18.38,36.66 LED5.6
5G
  Top 0.203: U3.17 15.45,32.82 15.45,35.14 17.87,37.57 18.38,37.57 LED5.5
5R
  Top 0.203: U3.12 18.17,32.01 18.17,33.93 19.59,35.34 19.59,37.97 19.08,38.48 18.48,38.48 LED5.4
5V  (via drill 0.35)
  Top 0.254: v24.34,28.68 23.73,29.28 PS2.6
  Bottom 0.254: R7.1 21.41,29.18 21.41,28.88 22.52,27.77 23.33,27.77 24.23,28.68 v24.34,28.68 25.14,29.49 C19.1 25.24,29.49 26.66,30.9 | 26.66,30.9 28.88,30.9 29.69,31.71 29.89,31.71 U$4.P$1 | CHARGER.1 24.03,34.54 24.03,33.63 25.08,32.61 25.94,32.61 26.66,31.82 26.66,30.9
6B  (via drill 0.35)
  Top 0.203: v17.06,34.89 17.06,34.13 16.96,34.03 16.96,32.82 U3.14 | v8.88,34.94 8.68,34.94 7.87,34.13 LED6.6
  Bottom 0.203: v17.06,34.89 16.91,34.94 16.66,34.94 v8.88,34.94
6G  (via drill 0.35)
  Top 0.203: v16.46,34.33 16.46,32.82 U3.15 | v9.49,34.33 8.58,33.43 LED6.5
  Bottom 0.203: v9.49,34.33 v16.46,34.33
6R  (via drill 0.35)
  Top 0.203: U3.11 18.17,31.51 18.58,31.51 19.03,31.96 v18.98,32.01 | LED6.4 9.19,32.92 10.3,32.92 v10.5,33.12
  Bottom 0.203: v10.5,33.12 11.91,33.12 13.02,32.01 v18.98,32.01
7B
  Top 0.203: U1.16 9.59,17.87 9.59,15.75 8.48,14.64 8.48,14.13 7.47,13.12 7.47,9.49 8.07,8.88 8.07,8.58 6.26,6.76 6.05,6.76 3.23,9.59 3.23,18.38 LED7.6
7G  (via drill 0.35)
  Top 0.203: 6.36,6.36 6.51,6.51 | 6.51,6.51 8.48,8.48 8.48,8.98 7.87,9.59 7.87,13.02 8.88,14.03 8.88,14.54 10.09,15.75 10.09,17.87 U1.17 | 2.32,18.38 LED7.5 2.32,18.27 v2.32,10.6 | 6.51,6.51 v6.66,6.36
  Bottom 0.203: v2.32,10.6 2.32,10.3 6.26,6.36 v6.66,6.36
7R
  Top 0.203: U1.12 7.37,18.78 4.34,18.78 3.53,19.59 1.91,19.59 1.41,19.08 1.41,18.48 LED7.4
8B  (via drill 0.35)
  Top 0.203: v8.48,11.71 8.28,11.91 8.28,12.92 9.29,13.93 9.29,14.44 10.6,15.75 10.6,17.87 U1.18 | 5.35,8.28 5.4,8.22 | LED8.6 5.75,7.87 5.54,8.08 5.4,8.22 | v5.53,10.38 5.53,9.1 5.4,8.98 5.4,8.22
  Bottom 0.203: v8.48,11.71 6.46,9.69 6.06,9.66 5.7,9.99 5.7,10.17 v5.53,10.38
8G  (via drill 0.35)
  Top 0.203: v8.88,12.72 9.69,13.53 9.69,14.34 11.31,15.95 11.31,18.68 U1.19 | v6.33,10.35 6.33,10.04 5.95,9.59 5.95,8.98 6.36,8.58 LED8.5
  Bottom 0.203: v8.88,12.72 8.68,12.72 6.49,10.53 v6.33,10.35
8R
  Top 0.203: U1.13 8.07,17.87 8.07,14.23 7.06,13.22 7.06,9.19 LED8.4
BAT_MEAS  (via drill 0.35)
  Top 0.203: v22.72,13.73 21,13.73 20.19,12.92 20.19,9.29 20.5,8.98 20.5,7.97 ISP1507.38 | v24.23,15.24 27.77,15.24 28.38,15.85 30.19,15.85 33.02,13.02 v34.64,13.02
  Bottom 0.203: v24.23,15.24 v22.72,13.73 | v34.64,13.02 36.35,13.02 36.66,12.72 R6.2 36.66,12.82 38.07,12.82 C20.1 37.77,12.92 37.77,14.13 R5.1
GND  (via drill 0.35)
  Top 0.203: U1.21 9.65,19.69 U1.EP 9.15,20.19 9.15,20.57 | U1.4 9.15,20.57 | U2.4 29.72,19.69 U2.EP 30.72,20.69 U2.20 | U3.4 16.38,30.48 | 16.38,30.48 U3.EP | 16.38,30.48 17.38,29.48 U3.6 17.38,27.47 C5.2 | ISP1507.21 ISP1507.19 20.85,5.01 20.72,4.88 20.72,4.78 ISP1507.18 | LSM303AGR.P$6 19.58,20.33 19.58,19.95 19.31,19.68 LSM303AGR.P$8 v18.04,19.68 | v18.04,19.68 v18.03,19.69 18.03,15.86 C16.2 | 18.04,15.86 v18.04,19.68 | 6.6,27.81 GND-C3.1 6.89,27.46 5.78,27.49 3.19,24.87 LED7.1 | 6.6,27.81 6.22,27.81 5.87,27.46 | C1.2 7.1,27.32 6.6,27.81 | U1.6 8.2,21.89 8.2,21.51 8.42,21.29 8.44,21.29 9.15,20.57 | v27.94,17.91 27.97,17.94 U2.6 | ISP1507.25 23.17,4.58 ISP1507.24 22.28,4.78 22.28,4.88 22.15,5.01 ISP1507.23 | ISP1507.7 17.08,4.78 ISP1507.8 | v4.14,12.7 4.84,12.72 4.83,12.72 | v7.49,32.39 7.39,32.39 LED6.2 | 24.71,17.63 25.06,17.65 25.09,17.6 26.18,17.6 C9.2
  Top 0.254: U2.6 28.04,18.76 28.45,18.76 29.39,19.69 29.72,19.69
  Bottom 0.203: 14.73,24.53 v14.73,24.64 | v8.64,26.42 7.8,25.58 U$2.P$30 | v22.28,16.74 22.23,16.87 v22.23,19.69
  other vias: 25.02,26.92 28.19,24.77 24.51,23.37 26.16,14.48 23.75,16 23.62,19.69 28.83,4.83 12.57,17.53 24.38,38.35 26.92,34.54 10.85,30.63 10.03,31.88 12.19,33.66 9.27,10.16 5.94,11.07 9.78,5.71 3.94,10.03 24.26,36.45 25.65,32 32.77,14.48 16.76,11.05 17.91,13.72 23.62,18.29 35.26,15.8
  pour Top: 3.81,4.45 34.54,4.45 42.16,11.68 42.16,29.46 29.46,42.16 10.41,42.16 -2.29,29.46 -2.29,10.41
  pour Bottom: -2.29,10.41 3.81,4.45 34.54,4.45 42.16,11.68 42.16,29.46 29.46,42.16 10.41,42.16 -2.29,29.46
INT_1  (via drill 0.35)
  Top 0.203: v21.18,9.59 21.81,8.98 21.81,7.97 ISP1507.34 | v20.8,17.77 20.19,18.38 LSM303AGR.P$12 | v2.65,29.25 2.58,29.25 0.88,27.55 v0.88,26.3 | v4.56,27.85 4.68,27.97 5.04,27.97 9.59,32.51 11.05,32.51 11.41,32.15 v11.41,26.66
  Bottom 0.203: v21.18,9.59 21.2,9.89 20.8,10.3 v20.8,17.77 20.8,19.59 17.47,22.92 17.47,22.95 16.33,24.06 14.5,24.06 11.93,26.66 v11.41,26.66 | U$2.P$35 3.12,20.6 2.32,20.6 0.8,22.11 0.8,26.18 0.88,26.25 v0.88,26.3 | v2.65,29.25 4.05,27.85 v4.56,27.85
INT_2  (via drill 0.35)
  Top 0.203: v21.71,10.2 21,10.2 20.6,9.79 20.6,9.39 21.1,8.88 21.1,7.97 ISP1507.36 | v21.41,17.24 21.1,17.27 21,17.16 20.5,17.16 19.69,17.97 LSM303AGR.P$11
  Bottom 0.203: v21.71,10.2 21.71,16.96 v21.41,17.24 21.41,20.3 18.38,23.33 18.38,24.54 15.65,27.26 11.21,27.26 10.8,26.86 10.8,23.53 7.87,20.6 7.06,20.6 U$2.P$26
LP_TRIG  (via drill 0.35)
  Top 0.203: v22.21,6.56 22.21,7.27 ISP1507.33 | 30.09,16.76 v30.7,16.15 | 30.09,16.76 30.09,17.37 30.19,17.47 30.19,17.87 U2.10 | U1.10 6.96,19.69 4.84,21.81 4.84,25.75 v6,26.91 | U3.10 18.17,31 18.58,31 18.78,31.2 v19.08,31.2 19.18,31.2 19.49,30.9 20.5,30.9 20.8,30.6 20.8,29.08 v19.69,27.97 | 30.09,16.76 29.49,16.76 29.18,16.46 24.08,16.46 v22.79,17.36
  Bottom 0.203: 25.65,6.56 30.29,6.56 33.93,10.2 33.93,11 30.7,14.23 v30.7,16.15 | 25.65,6.56 v22.21,6.56 | v6,26.91 5.75,28.07 8.88,31.2 v19.08,31.2 | v22.79,17.36 22.79,20.12 18.78,24.13 18.78,27.06 v19.69,27.97 | R2.1 25.65,7.11 25.65,6.56
MOD_RES  (via drill 0.35)
  Top 0.203: v0.8,13.43 0.8,22.31 v1.41,22.92 | ISP1507.47 17.67,7.27 17.67,6.76 v17.59,6.69
  Bottom 0.203: v17.59,6.69 13.22,6.69 12.11,7.67 6.56,7.67 4.49,9.74 4.54,10.29 4.22,10.61 3.64,10.59 v0.8,13.43 | v1.41,22.92 3.02,22.92 3.12,23.02 U$2.P$33
N$1
  Top 0.203: U1.24 11.41,21.2 11.41,23.53 C2.2
N$2
  Top 0.203: U1.2 10.09,22.01 10.09,23.53 C2.1
N$4
  Top 0.203: U1.1 10.7,22.01 10.7,24.23 10.8,24.34 11.81,24.34 13.33,22.82 C3.1
N$5
  Top 0.203: U1.23 11.41,20.7 12.62,20.7 13.33,21.41 C3.2
N$7
  Top 0.203: U2.2 27.97,20.6 26.46,20.6 26.35,20.5 C10.1
N$8
  Top 0.203: U2.24 28.68,21.91 26.46,21.91 26.35,21.81 C10.2
N$9
  Top 0.203: U2.1 27.97,21.1 25.75,21.1 25.55,21.3 25.55,22.82 26.25,23.53 C11.1
N$10
  Top 0.203: U2.23 29.18,22.01 29.18,22.42 26.76,24.84 26.35,24.84 C11.2
N$11
  Top 0.203: U3.2 15.35,28.68 15.35,27.47 14.94,27.06 C6.1
N$13
  Top 0.203: U3.24 14.03,29.38 14.03,27.97 13.63,27.57 13.63,27.06 C6.2
N$14
  Top 0.203: U3.1 14.84,28.68 14.84,28.27 14.23,27.67 14.23,26.46 14.03,26.25 13.12,26.25 12.21,27.16 12.21,28.68 C7.1
N$15
  Top 0.203: U3.23 14.03,29.99 12.21,29.99 C7.2
N$16
  Top 0.254: U1.22 11.41,20.09 C4.1
N$17
  Top 0.254: U2.22 29.79,22.01 29.79,23.43 C12.1
N$18
  Top 0.254: U3.22 14.03,30.5 13.02,30.5 12.21,31.3 C8.1
N$22
  Top 0.203: LSM303AGR.P$5 20.09,20.5 20.09,21.71 19.99,21.81 C15.1
N$23  (via drill 0.35)
  Top 0.254: v22.82,28.38 22.82,29.28 PS2.5
  Bottom 0.254: v22.82,28.38 22.82,28.98 23.02,29.18 R3.2
N$24
  Top 0.203: ISP1507.20 21.2,4.44 21.81,4.44 ISP1507.22
N$25
  Top 0.203: ISP1507.2 16.15,6.86 13.73,6.86 11.71,8.88 NFC.2
N$26
  Top 0.203: ISP1507.4 16.15,6.26 11.71,6.26 NFC.1
N$27
  Bottom 0.254: R8.1 12.95,15 SW1.1
N$28
  Bottom 0.254: SW2.1 15.49,15.24 R10.1
N$29
  Top 0.254: CHARER.C 20.09,31.71 21,31.71 21.71,32.41 PS2.3
N$30  (via drill 0.35)
  Top 0.254: v20.09,29.18 20.09,30.09 CHARER.A
  Bottom 0.254: v20.09,29.18 21.3,30.4 R7.2
N$31
  Bottom 0.254: R9.1 15.75,19.67 SW3.1
N$32  (via drill 0.35)
  Top 0.254: v23.11,24.38 17.27,24.38 SW4.1
  Bottom 0.254: 23.12,22.52 R4.1 v23.11,24.38
RST  (via drill 0.35)
  Top 0.203: v34.44,9.39 34.44,10.09 31.15,13.38 | 31.15,13.38 30.19,14.34 29.08,14.34 U$1.P$10 | ISP1507.13 18.98,5.14 18.98,5.45 19.49,5.95 v21.2,5.95 | 31.15,13.38 v30.44,13.18
  Bottom 0.203: v34.44,9.39 30.6,5.55 21.91,5.55 21.61,5.85 21.51,5.85 21.41,5.95 v21.2,5.95 | v30.44,13.18 31.81,11.81 31.81,11.61 U$3.P$10
S-RX  (via drill 0.35)
  Top 0.203: v10.9,12.32 v15.04,8.18 | ISP1507.45 18.39,7.29 v18.39,6.6
  Bottom 0.203: U$2.P$36 3.8,18.59 4.5,18.59 4.74,18.27 4.74,15.19 5.31,14.62 5.35,14.54 5.35,13.83 5.65,13.53 8.35,13.53 8.48,13.65 9.31,13.65 10.62,12.32 v10.9,12.32 | v15.04,8.18 17.73,8.18 18.03,7.87 18.03,7.02 18.14,6.91 18.14,6.85 v18.39,6.6
S-TX  (via drill 0.35)
  Top 0.203: ISP1507.43 18.9,6.9 18.97,6.83 18.97,6.81 v19.18,6.76
  Bottom 0.203: U$2.P$25 7.06,19.18 7.9,19.18 11.28,15.54 11.28,12.87 14.44,9.59 18.98,9.59 19.59,8.98 19.59,8.58 19.09,8.09 19.12,6.71 v19.18,6.76
SCL  (via drill 0.35)
  Top 0.203: v24.28,17.01 22.23,18.48 21.2,18.48 LSM303AGR.P$1 | v24.28,17.01 25.24,16.86 29.08,16.86 29.69,17.47 29.69,17.87 U2.9 | v18.98,8.78 19.18,8.58 19.18,7.97 ISP1507.42 | v5.45,24.94 5.45,21.71 6.96,20.19 7.37,20.19 U1.9 | v18.98,30.4 18.17,30.4 U3.9 | v24.28,17.01 | v15.04,8.98 15.04,13.02 17.06,15.04 17.06,21.51 19.39,23.83 23.43,23.83 v24.34,24.74
  Bottom 0.203: 15.04,8.78 13.63,8.78 9.14,13.3 8.63,13.3 7.04,11.68 3.69,11.68 1.7,13.68 1.7,15.56 1.81,15.45 3.12,15.45 U$2.P$39 3.23,15.35 3.93,15.35 | 15.04,8.78 v18.98,8.78 | v5.45,24.94 5.45,25.75 5.3,25.9 | 5.3,25.9 2.62,28.58 1.71,28.58 | 5.3,25.9 5.65,26.25 7.37,26.25 11.51,30.4 v18.98,30.4 18.98,29.49 19.89,28.58 20.8,28.58 24.49,24.89 | 26.05,18.03 26.05,23.33 24.49,24.89 | 26.05,18.03 26.05,17.97 | v24.28,17.01 25.03,17.01 26.05,18.03 | 24.49,24.89 v24.34,24.74 | v15.04,8.98 15.04,8.78
SDA  (via drill 0.35)
  Top 0.203: 20.9,21.81 20.9,20.19 LSM303AGR.P$4 | 20.9,21.81 20.9,22.11 20.5,22.52 19.39,22.52 17.46,20.61 17.46,15.23 19.79,12.92 19.79,7.97 ISP1507.40 | 25.65,18.17 26.86,18.17 27.77,17.27 28.98,17.27 29.18,17.47 29.18,17.87 U2.8 | 20.9,21.81 v21.91,21.81 | v8.78,24.64 8.18,24.64 7.77,24.23 7.77,23.12 6.66,22.01 6.66,21 6.96,20.7 7.37,20.7 U1.8 | U3.8 18.17,29.89 18.68,29.89 18.88,29.69 18.88,29.28 v17.97,28.38 17.97,28.27 v19.39,26.86
  Top 0.254: v25.32,18.17 25.65,18.17
  Bottom 0.203: v25.32,18.17 25.32,21.43 24.94,21.81 v21.91,21.81 21.91,24.34 v19.39,26.86 | U$2.P$22 6.96,15.45 6.36,15.45 5.55,16.26 5.55,22.21 5.75,22.42 8.38,22.42 8.78,22.82 v8.78,24.64 8.78,25.34 11.81,28.38 v17.97,28.38
SWCLK  (via drill 0.35)
  Top 0.203: 23.63,6.86 ISP1507.30 23.73,6.86 v25.55,8.68 | 26.35,11.61 U$1.P$7 26.46,11.61 v27.67,10.4
  Bottom 0.203: 27.72,10.45 29.28,8.88 U$3.P$7 | 27.72,10.45 27.67,10.5 27.57,10.5 27.47,10.6 v25.55,8.68 | v27.67,10.4 27.72,10.45
SWDIO  (via drill 0.35)
  Top 0.203: 23.63,6.26 ISP1507.28 23.73,6.26 25.85,6.26 v27.26,7.67 | v27.26,9.49 26.05,10.7 25.55,10.7 U$1.P$6
  Bottom 0.203: U$3.P$6 28.27,7.87 28.07,7.67 v27.26,7.67 v27.26,9.49
SWITCH1  (via drill 0.35)
  Top 0.203: v15.65,10.9 17.27,9.29 17.27,7.97 ISP1507.48
  Bottom 0.203: v15.65,10.9 14.94,11.61 14.92,11.61 R8.2 C21.1
SWITCH2  (via drill 0.35)
  Top 0.203: v17.87,10.2 17.87,7.97 ISP1507.46
  Bottom 0.203: v17.87,10.2 17.87,11.32 C23.1 R10.2
SWITCH3  (via drill 0.35)
  Top 0.203: v18.68,10.2 18.38,9.89 18.38,8.58 18.48,8.48 18.48,7.97 ISP1507.44
  Bottom 0.203: v18.68,10.2 18.68,20.5 17.49,20.5 C22.1 R9.2
SWITCH4  (via drill 0.35)
  Top 0.203: v22.72,11.31 23.02,11 23.02,8.88 22.52,8.38 22.52,7.97 ISP1507.32
  Bottom 0.203: v22.72,11.31 22.11,11.91 22.11,15.75 24.34,18.1 24.34,21.1 C24.1 24.23,21.1 23.12,21.1 R4.2
SWO  (via drill 0.35)
  Top 0.203: ISP1507.11 18.27,5.14 18.27,5.25 18.32,5.29 18.32,5.7 v18.42,5.8 | v25.65,13.43 26.46,12.62 27.16,12.62 U$1.P$8 27.26,12.62 v28.58,11.31
  Bottom 0.203: 25.75,13.22 25.75,13.33 v25.65,13.43 22.26,10.04 22.26,9.87 19.75,7.33 19.75,6.38 19.15,5.8 v18.42,5.8 | v28.58,11.31 30.09,9.79 U$3.P$8
U-RX  (via drill 0.35)
  Top 0.203: v17.57,5.85 17.57,5.14 ISP1507.9 | v1.41,12.01 v1.41,16.66
  Bottom 0.203: v17.57,5.85 12.92,5.85 12.21,5.14 7.67,5.14 | 7.64,5.14 7.67,5.14 | v1.41,16.66 3.12,16.66 U$2.P$38 | v1.41,12.01 1.71,12.01 3.33,10.4 3.33,9.79 6.16,6.96 6.86,6.96 7.67,6.16 7.67,5.14
U-TX  (via drill 0.35)
  Top 0.203: 16.15,5.55 ISP1507.6 15.78,5.55 15.38,5.13 11.19,5.13 10.32,5.95 10.32,12.62 10.68,12.95 v10.68,13.63
  Bottom 0.203: v10.68,13.63 7.77,16.66 7.06,16.66 U$2.P$23
VIN
  Top 0.254: PS2.1 23.73,32.31 23.93,32.11 24.03,32.11 26.86,29.28 26.86,28.27 BAT_SWITCH.2
  Bottom 0.254: R1.1 27.47,30.09 27.47,28.78 26.96,28.27 BAT_SWITCH.2 27.26,28.48 32.72,23.02 33.12,23.02 BAT_INPUT_PINS.1 33.22,23.02 33.22,21.51 32.72,21 BATTERY_JST.1
VIN_LDO
  Top 0.254: 33.63,27.57 33.43,27.37 33.43,27.26 33.22,27.06 PS1.1 33.12,27.06 32.92,27.06 | 33.63,27.57 35.75,27.57 36.25,27.06 PS1.6 36.35,27.06 37.77,27.06 C13.1 | BAT_SWITCH.1 29.49,28.17 32.1,28.17 32.2,28.04 33.13,28.04 33.63,27.57
  Bottom 0.254: R5.2 36.45,14.23 36.45,20.7 34.54,22.62 34.54,23.93 35.65,25.04 STLQ015.3 35.34,24.84 34.64,25.55 34.64,26.35 | 34.64,26.35 35.24,26.96 35.65,26.96 STLQ015.1 | R1.2 28.88,30.09 28.88,28.78 29.38,28.27 BAT_SWITCH.1 29.59,28.17 31.41,26.35 34.64,26.35

### Text on the board
tPlace: K. Schram, M. Weyn, D. Subotic
tNames: L5 | CHARGER | - | + | L6 | L4 | GND1 | GND4 | GND2 | BAT_SWITCH | GND3 | SW4 | + | - | BAT INPUT | L7 | L3 | SW3 | LSM303 | SW1 | SW2 | L1 | L8 | L2 | NFC
bNames: CHARGER | - | + | GND4 | GND1 | GND3 | GND2 | BAT_SWITCH | SW4 | + | BAT INPUT | - | SW3 | SW1 | SW2 | NFC | 5 | LED BLE BOARD